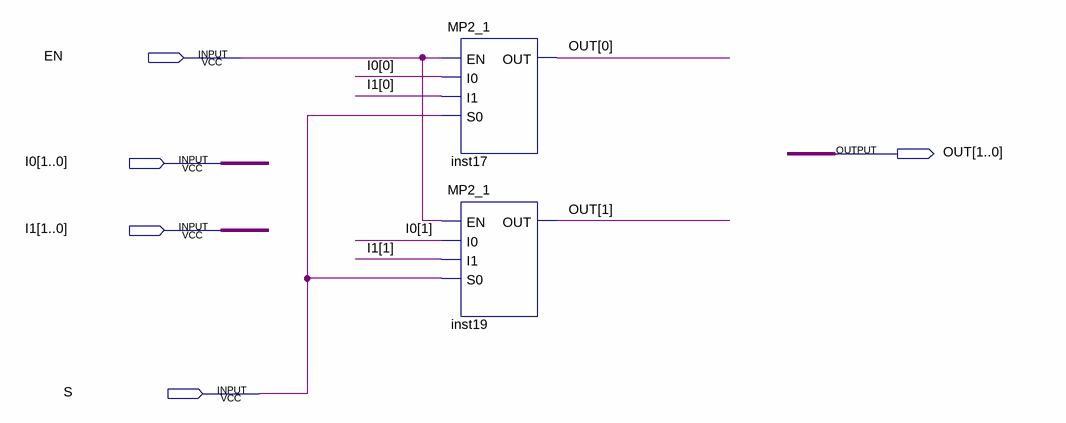
[diagram p0: schematic sheet]
// Quartus schematic MP2_2.bdf as structural Verilog: 2 symbols, 5 pins
module MP2_2 (
  input  EN,
  input  [1:0] I0,
  input  [1:0] I1,
  input  S,
  output [1:0] OUT
);

  MP2_1 inst17 (.EN(EN), .I0(I0[0]), .I1(I1[0]), .S0(S), .OUT(OUT[0]));
  MP2_1 inst19 (.EN(EN), .I0(I0[1]), .I1(I1[1]), .S0(S), .OUT(OUT[1]));
endmodule
